# Altium project UVSD_HA_Balloon_OBC.PrjPcb
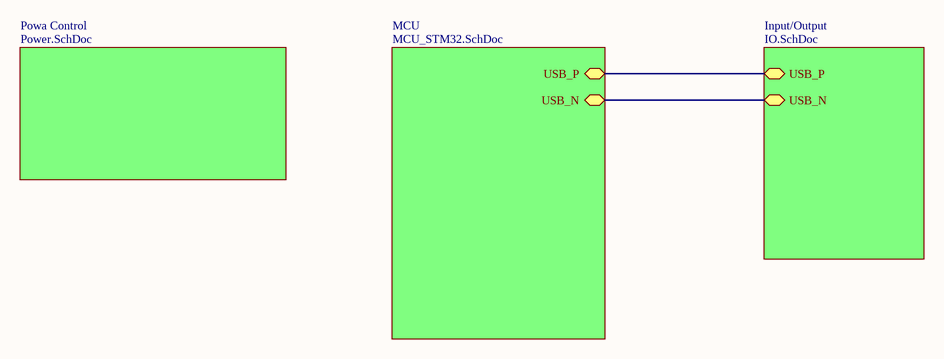
[diagram p0: Main.SchDoc]
2 sheets, 1 parts. Net scope: hierarchical (ports join the sheet entries above them; power ports are global).
Sheets:
  Main.SchDoc
    MCU = MCU_STM32.SchDoc

## Sheet Main.SchDoc: UVSD_HABalloon_OBC
size A3; DrawnBy: Evan Peters; Revision: 1; SheetNumber: 1; SheetTotal: 4

### Sub-sheets
Input/Output = IO.SchDoc (file not in this document): USB_P (bidir), USB_N (bidir)
MCU = MCU_STM32.SchDoc: USB_P (bidir), USB_N (bidir)
Powa Control = Power.SchDoc (file not in this document): no entries

### Nets
NetU1_100: sheet MCU/USB_N, sheet Input/Output/USB_N
NetU1_101: sheet MCU/USB_P, sheet Input/Output/USB_P

## Sheet MCU_STM32.SchDoc: MCU_STM32
size A3; DrawnBy: Evan Peters; Revision: 1; SheetNumber: 2; SheetTotal: 4
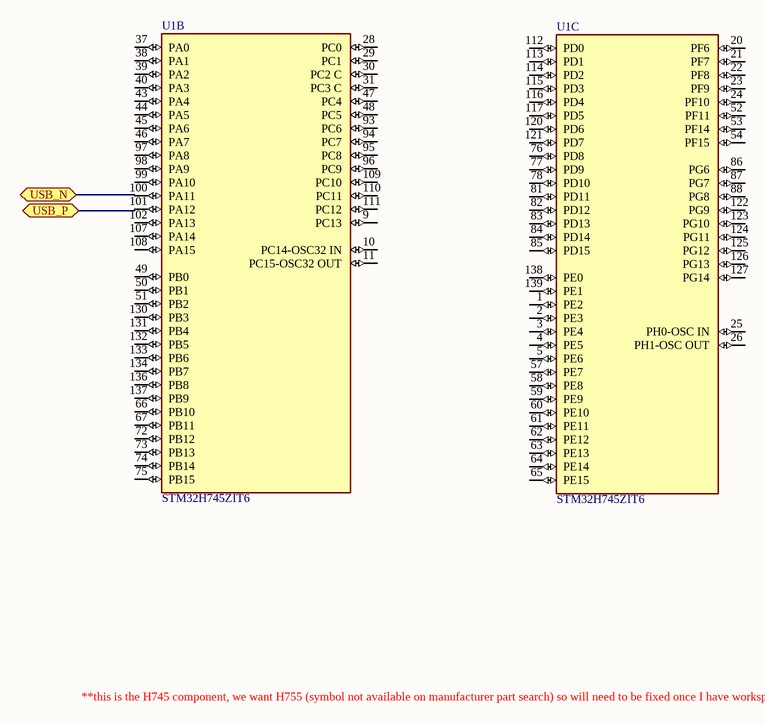
[diagram p1: MCU_STM32.SchDoc]

### Parts
U1  STM32H745ZIT6  [FP-LQFP144-1A-MFG]  (parts B,C of 3)

### Ports
USB_N (bidir, see Main[5B], IO[2B]), USB_P (bidir, see Main[5B], IO[2B])

### Nets
NetU1_100: U1.100(PA11) ; port USB_N
NetU1_101: U1.101(PA12) ; port USB_P

Not connected (* = marked no-connect by the designer): U1 1(PE2) 2(PE3) 3(PE4) 4(PE5) 5(PE6) 9(PC13) 10(PC14-OSC32_IN) 11(PC15-OSC32_OUT) 20(PF6) 21(PF7) 22(PF8) 23(PF9) 24(PF10) 25(PH0-OSC_IN) 26(PH1-OSC_OUT) 28(PC0) 29(PC1) 30(PC2_C) 31(PC3_C) 37(PA0) 38(PA1) 39(PA2) 40(PA3) 43(PA4) 44(PA5) 45(PA6) 46(PA7) 47(PC4) 48(PC5) 49(PB0) 50(PB1) 51(PB2) 52(PF11) 53(PF14) 54(PF15) 57(PE7) 58(PE8) 59(PE9) 60(PE10) 61(PE11) 62(PE12) 63(PE13) 64(PE14) 65(PE15) 66(PB10) 67(PB11) 72(PB12) 73(PB13) 74(PB14) 75(PB15) 76(PD8) 77(PD9) 78(PD10) 81(PD11) 82(PD12) 83(PD13) 84(PD14) 85(PD15) 86(PG6) 87(PG7) 88(PG8) 93(PC6) 94(PC7) 95(PC8) 96(PC9) 97(PA8) 98(PA9) 99(PA10) 102(PA13) 107(PA14) 108(PA15) 109(PC10) 110(PC11) 111(PC12) 112(PD0) 113(PD1) 114(PD2) 115(PD3) 116(PD4) 117(PD5) 120(PD6) 121(PD7) 122(PG9) 123(PG10) 124(PG11) 125(PG12) 126(PG13) 127(PG14) 130(PB3) 131(PB4) 132(PB5) 133(PB6) 134(PB7) 136(PB8) 137(PB9) 138(PE0) 139(PE1)

### Notes on the sheet
- **this is the H745 component, we want H755 (symbol not available on manufacturer part search) so will need to be fixed once I have workspace access to save a custom component

### Library data of the parts
U1 = CMP-12105-000054-1: HIGH-PERFORMANCE AND DSP WITH DP; Manufacturer: STMicroelectronics; Number Of Timers/Counters: 20; Min Supply Voltage: 1.62V; Frequency: 480MHz; Number Of I2C Channels: 4; Memory Type: FLASH; Number Of I/Os: 97; Number Of Pwm Channels: 42; Number Of Usb Channels: 2; Ram Size: 1MBytes; Memory Size: 2MBytes; Data Bus Width: 32bits; Number Of Adc Channels: 23; Number Of Ethernet Channels: 1; Number Of Uart Channels: 9; Interface: I2C,SPI,UART,USART,CAN,USB,LIN,IrDA,Ethernet,I2S,Other; Number Of A/D Converters: 3; Max Junction Temp: +125°C; Max Supply Voltage: 3.6V; Description: ARM® Cortex®-M4, Cortex®-M7 STM32H7 Microcontroller IC 32-Bit Dual-Core 240MHz, 480MHz 2MB (2M x 8) FLASH 144-LQFP (20x20); Core Architecture: ARM Cortex-M4, Cortex-M7; Number Of Spi Channels: 6; Standoff Height: 0.05mm; Ambient Temperature Range Low: -40°C; Lead Free: Yes; Manufacturer Part Number: STM32H745ZIT6; Automotive: No; Height: 1.6mm; Device Class L1: Integrated Circuits (ICs); Ambient Temperature Range High: +85°C; RoHS: TRUE; Temperature Range High: +125°C; Temperature: -40°C to +125°C; Category: IC; Device Class L2: Embedded Processors and Controllers; Number Of Cores: 2; Temperature Range Low: -40°C; Octopart: https://octopart.com/stm32h745zit6-stmicroelectronics-100293939; Digikey Description: HIGH-PERFORMANCE AND DSP WITH DP; Package: LQFP144-1A; Device Class L3: Microcontrollers; ComponentLink2URL: https://www.st.com/resource/en/datasheet/stm32h745zi.pdf; ComponentLink2Description: Datasheet